# Altium schematic sheet LA25-P 8Aac ADC 센싱회로1.SchDoc: 8A Sensing for LA25-P
size A4
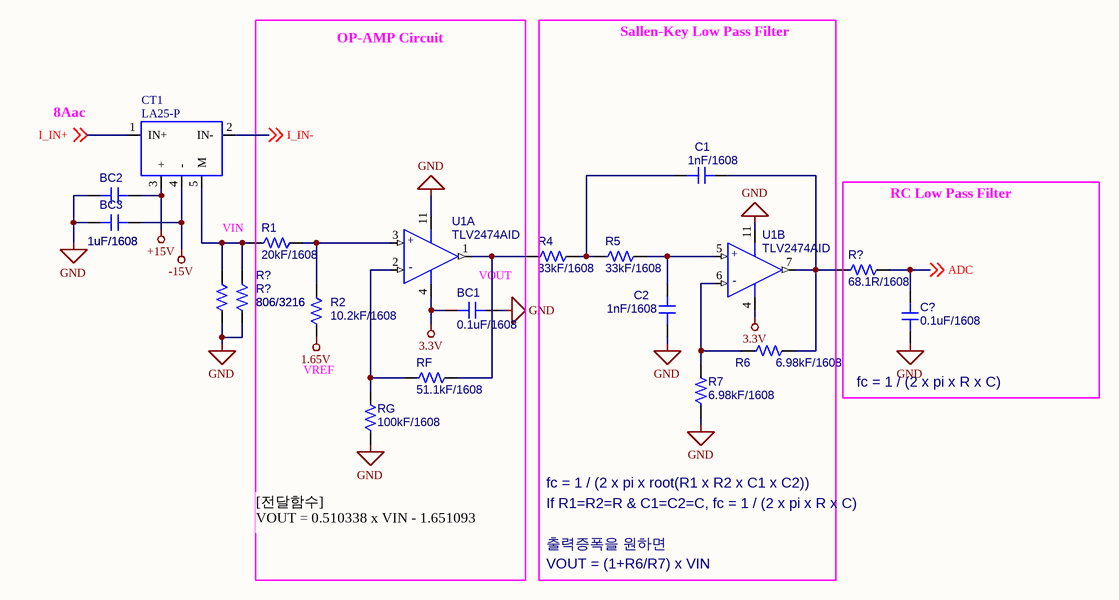
[diagram p0: LA25-P 8Aac ADC 센싱회로1.SchDoc]

## Parts
(Parts that share a designator on the sheet are numbered #1, #2 ... from top to bottom, then left to right.)
BC1  0.1uF/1608  [C-1608]
BC2  1uF/1608  [C-1608]
BC3  1uF/1608  [C-1608]
C1  1nF/1608  [C-1608]
C2  1nF/1608  [C-1608]
C?  0.1uF/1608  [C-1608]
CT1  LA25-P
R1  20kF/1608  [R-1608]
R2  10.2kF/1608  [R-1608]
R4  33kF/1608  [R-1608]
R5  33kF/1608  [R-1608]
R6  6.98kF/1608  [R-1608]
R7  6.98kF/1608  [R-1608]
R?#1  68.1R/1608  [R-1608]
R?#2  806/3216  [R-1608]
R?#3  806/3216  [R-1608]
RF  51.1kF/1608  [R-1608]
RG  100kF/1608  [R-1608]
U1  TLV2474AID  [SO-14]  (parts A,B of 4)

## Blocks framed on the sheet
OP-AMP Circuit: BC1 R1 R2 RF RG U1

## Nets
1.65V: R2.2
3.3V: BC1.2 U1.4(+VCC)
+15V: BC2.1 CT1.3(+)
-15V: BC3.1 CT1.4(-)
GND: BC1.1 BC2.2 BC3.2 C2.2 C?.2 R7.1 R?#2.2 R?#3.2 RG.1 U1.11(-VCC)
ADC: C?.1 R?#1.2 ; off-sheet ADC
I_IN+: CT1.1(IN+) ; off-sheet I_IN+
I_IN-: CT1.2(IN-) ; off-sheet I_IN-
NetC1_1: C1.1 R6.2 R?#1.1 U1.7(OUT)
NetC1_2: C1.2 R4.2 R5.1
NetC2_1: C2.1 R5.2 U1.5(+IN)
NetCT1_5: CT1.5(M) R1.1 R?#2.1 R?#3.1
NetR1_2: R1.2 R2.1 U1.3(+IN)
NetR4_1: R4.1 RF.2 U1.1(OUT)
NetR6_1: R6.1 R7.2 U1.6(-IN)
NetRF_1: RF.1 RG.2 U1.2(-IN)

## Notes on the sheet
- Sallen-Key Low Pass Filter
- 8Aac
- (near R1) VIN
- RC Low Pass Filter
- VOUT
- VREF
- (near C?) fc = 1 / (2 x pi x R x C)
- [전달함수]
  VOUT = 0.510338 x VIN - 1.651093
- fc = 1 / (2 x pi x root(R1 x R2 x C1 x C2))
- If R1=R2=R & C1=C2=C, fc = 1 / (2 x pi x R x C)
- 출력증폭을 원하면
- VOUT = (1+R6/R7) x VIN
- PJT No
- This drawing is the property of SysInTeck.
- The information contained thereon may not be used
- or the drawing reproduced without written permission
- from SysInTeck.
- 이 도면은 시스인텍의 지적자산입니다. 따라서 시스인텍의 동의 없이
- 본 회로의 전체  또는 일부를 발취하여 사용하는 행위는 위법임을
- 알려드립니다.
- DrawnBy
- CheckedBy
- PCB No.
- Title
- Size
- A4
- DocumentNumber
- SysInTeck
- Rev
- BOM No.
- Date
- Sheet
- of
- (in symbol OPA4336_1, part A) +; -
- (in symbol OPA4336_1, part B) +; -

## Library data of the parts
BC1-BC3 C1 C2 C? = CAPACITOR NON-POL: PCB Footprint: C-1608
R1 R2 R?#2 R?#3 = R_Dup1: OriginalSymbolOrigin: (0,0); PSpiceTemplate: R^@REFDES %1 %2 ?TOLERANCE|R^@REFDES| @VALUE  ?TOLERANCE|\n.model R^@REFDES RES R=1 DEV=@TOLERANCE%|; Value: 6.98kF/1608; PCB Footprint: R-1608
R4-R7 R?#1 RF RG = R_Dup: Resistor; OriginalSymbolOrigin: (0,0); PSpiceTemplate: R^@REFDES %1 %2 ?TOLERANCE|R^@REFDES| @VALUE  ?TOLERANCE|\n.model R^@REFDES RES R=1 DEV=@TOLERANCE%|; Value: 22.1RF/1608; PCB Footprint: R-1608
U1 = OPA4336_1: PCB Footprint: SO-14